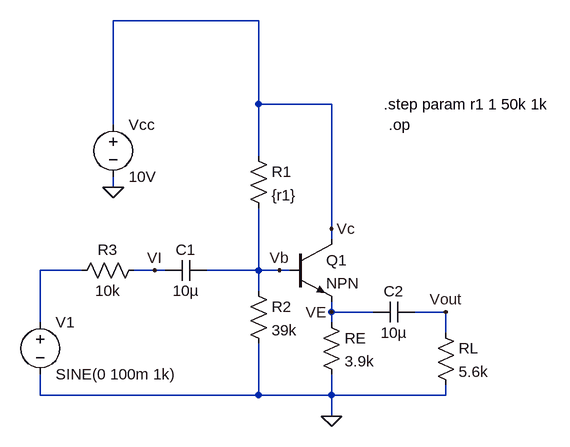
[diagram p0: schematic Common_Emitter_R1_Value.asc]
Common_Emitter_R1_Value.asc, the LTspice schematic file:
Version 4
SHEET 1 880 680
WIRE 208 -176 -16 -176
WIRE 208 -48 208 -176
WIRE 320 -48 208 -48
WIRE -16 -16 -16 -176
WIRE 208 32 208 -48
WIRE -16 80 -16 64
WIRE 320 144 320 -48
WIRE 320 160 320 144
WIRE -64 208 -128 208
WIRE 48 208 16 208
WIRE 64 208 48 208
WIRE 208 208 208 112
WIRE 208 208 128 208
WIRE 240 208 208 208
WIRE 256 208 240 208
WIRE 208 240 208 208
WIRE 320 272 320 256
WIRE 384 272 320 272
WIRE 496 272 448 272
WIRE -128 288 -128 208
WIRE 320 288 320 272
WIRE 496 304 496 272
WIRE -128 400 -128 368
WIRE 208 400 208 320
WIRE 208 400 -128 400
WIRE 320 400 320 368
WIRE 320 400 208 400
WIRE 496 400 496 384
WIRE 496 400 320 400
WIRE 320 432 320 400
FLAG -16 80 0
FLAG 320 272 VE
FLAG 320 144 Vc
FLAG 320 432 0
FLAG 496 272 Vout
FLAG 48 208 VI
FLAG 240 208 Vb
SYMBOL voltage -16 -32 R0
WINDOW 123 0 0 Left 0
WINDOW 39 0 0 Left 0
SYMATTR InstName Vcc
SYMATTR Value 10V
SYMBOL res 192 16 R0
WINDOW 0 36 40 Left 2
WINDOW 3 36 76 Left 2
SYMATTR InstName R1
SYMATTR Value {r1}
SYMBOL res 192 224 R0
WINDOW 0 36 40 Left 2
WINDOW 3 36 76 Left 2
SYMATTR InstName R2
SYMATTR Value 39k
SYMBOL res 304 272 R0
WINDOW 0 36 40 Left 2
WINDOW 3 36 76 Left 2
SYMATTR InstName RE
SYMATTR Value 3.9k
SYMBOL res 480 288 R0
WINDOW 0 36 40 Left 2
WINDOW 3 36 76 Left 2
SYMATTR InstName RL
SYMATTR Value 5.6k
SYMBOL voltage -128 272 R0
WINDOW 123 24 124 Left 2
WINDOW 39 0 0 Left 0
SYMATTR InstName V1
SYMATTR Value SINE(0 100m 1k)
SYMBOL res 32 192 R90
WINDOW 0 0 56 VBottom 2
WINDOW 3 32 56 VTop 2
SYMATTR InstName R3
SYMATTR Value 10k
SYMBOL cap 128 192 R90
WINDOW 0 0 32 VBottom 2
WINDOW 3 32 32 VTop 2
SYMATTR InstName C1
SYMATTR Value 10µ
SYMBOL cap 448 256 R90
WINDOW 0 0 32 VBottom 2
WINDOW 3 32 32 VTop 2
SYMATTR InstName C2
SYMATTR Value 10µ
SYMBOL npn 256 160 R0
WINDOW 0 56 32 Left 2
WINDOW 3 56 68 Left 2
SYMATTR InstName Q1
TEXT 400 -48 Left 2 !.step param r1 1 50k 1k
TEXT 408 -16 Left 2 !.op

The netlist it stands for:
* Common_Emitter_R1_Value.asc
Vcc Vc 0 10V
R1 Vc Vb {r1}
R2 Vb 0 39k
RE VE 0 3.9k
RL Vout 0 5.6k
V1 N001 0 SINE(0 100m 1k)
R3 VI N001 10k
C1 Vb VI 10µ
C2 Vout VE 10µ
Q1 Vc Vb VE 0 NPN
.model NPN NPN
.model PNP PNP
.lib standard.bjt
.step param r1 1 50k 1k
.op
.backanno
.end

* Results of the author's LTspice run, read from the files saved beside the schematic
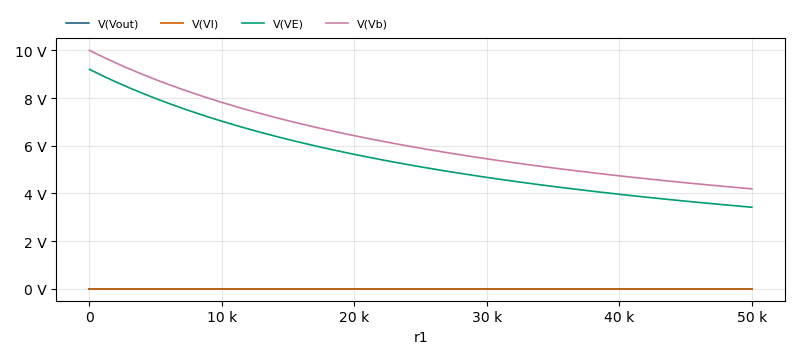
[diagram p1: Operating Point of Common_Emitter_R1_Value.asc, plotted from the saved traces]
* Operating Point, 1 run:
*   V(Vout): 515.4 fV at r1=1 , 191.6 fV at r1=50 k, min 191.6 fV, max 515.4 fV
*   V(VI): 1 pV at r1=1 , 419.2 fV at r1=50 k, min 419.2 fV, max 1 pV
*   V(VE): 9.204 V at r1=1 , 3.421 V at r1=50 k, min 3.421 V, max 9.204 V
*   V(Vb): 10 V at r1=1 , 4.192 V at r1=50 k, min 4.192 V, max 10 V
* From the log:
*   Semiconductor Device Operating Points:
*                           --- Bipolar Transistors ---
*   Name:       q1
*   Model:      npn
*   Ib:       2.34e-05
*   Ic:       2.34e-03
*   Vbe:      7.96e-01
*   Vbc:     -2.80e-04
*   Vce:      7.96e-01
*   BetaDC:   1.00e+02
*   Gm:       9.03e-02
*   Rpi:      1.11e+03
*   Rx:       0.00e+00
*   Ro:       2.61e+14
*   Cbe:      0.00e+00
*   Cbc:      0.00e+00
*   Cjs:      0.00e+00
*   BetaAC:   1.00e+02
*   Cbx:      0.00e+00
*   Ft:       0.00e+00